# EAGLE design slave-16 (EAGLE 9.6.2)
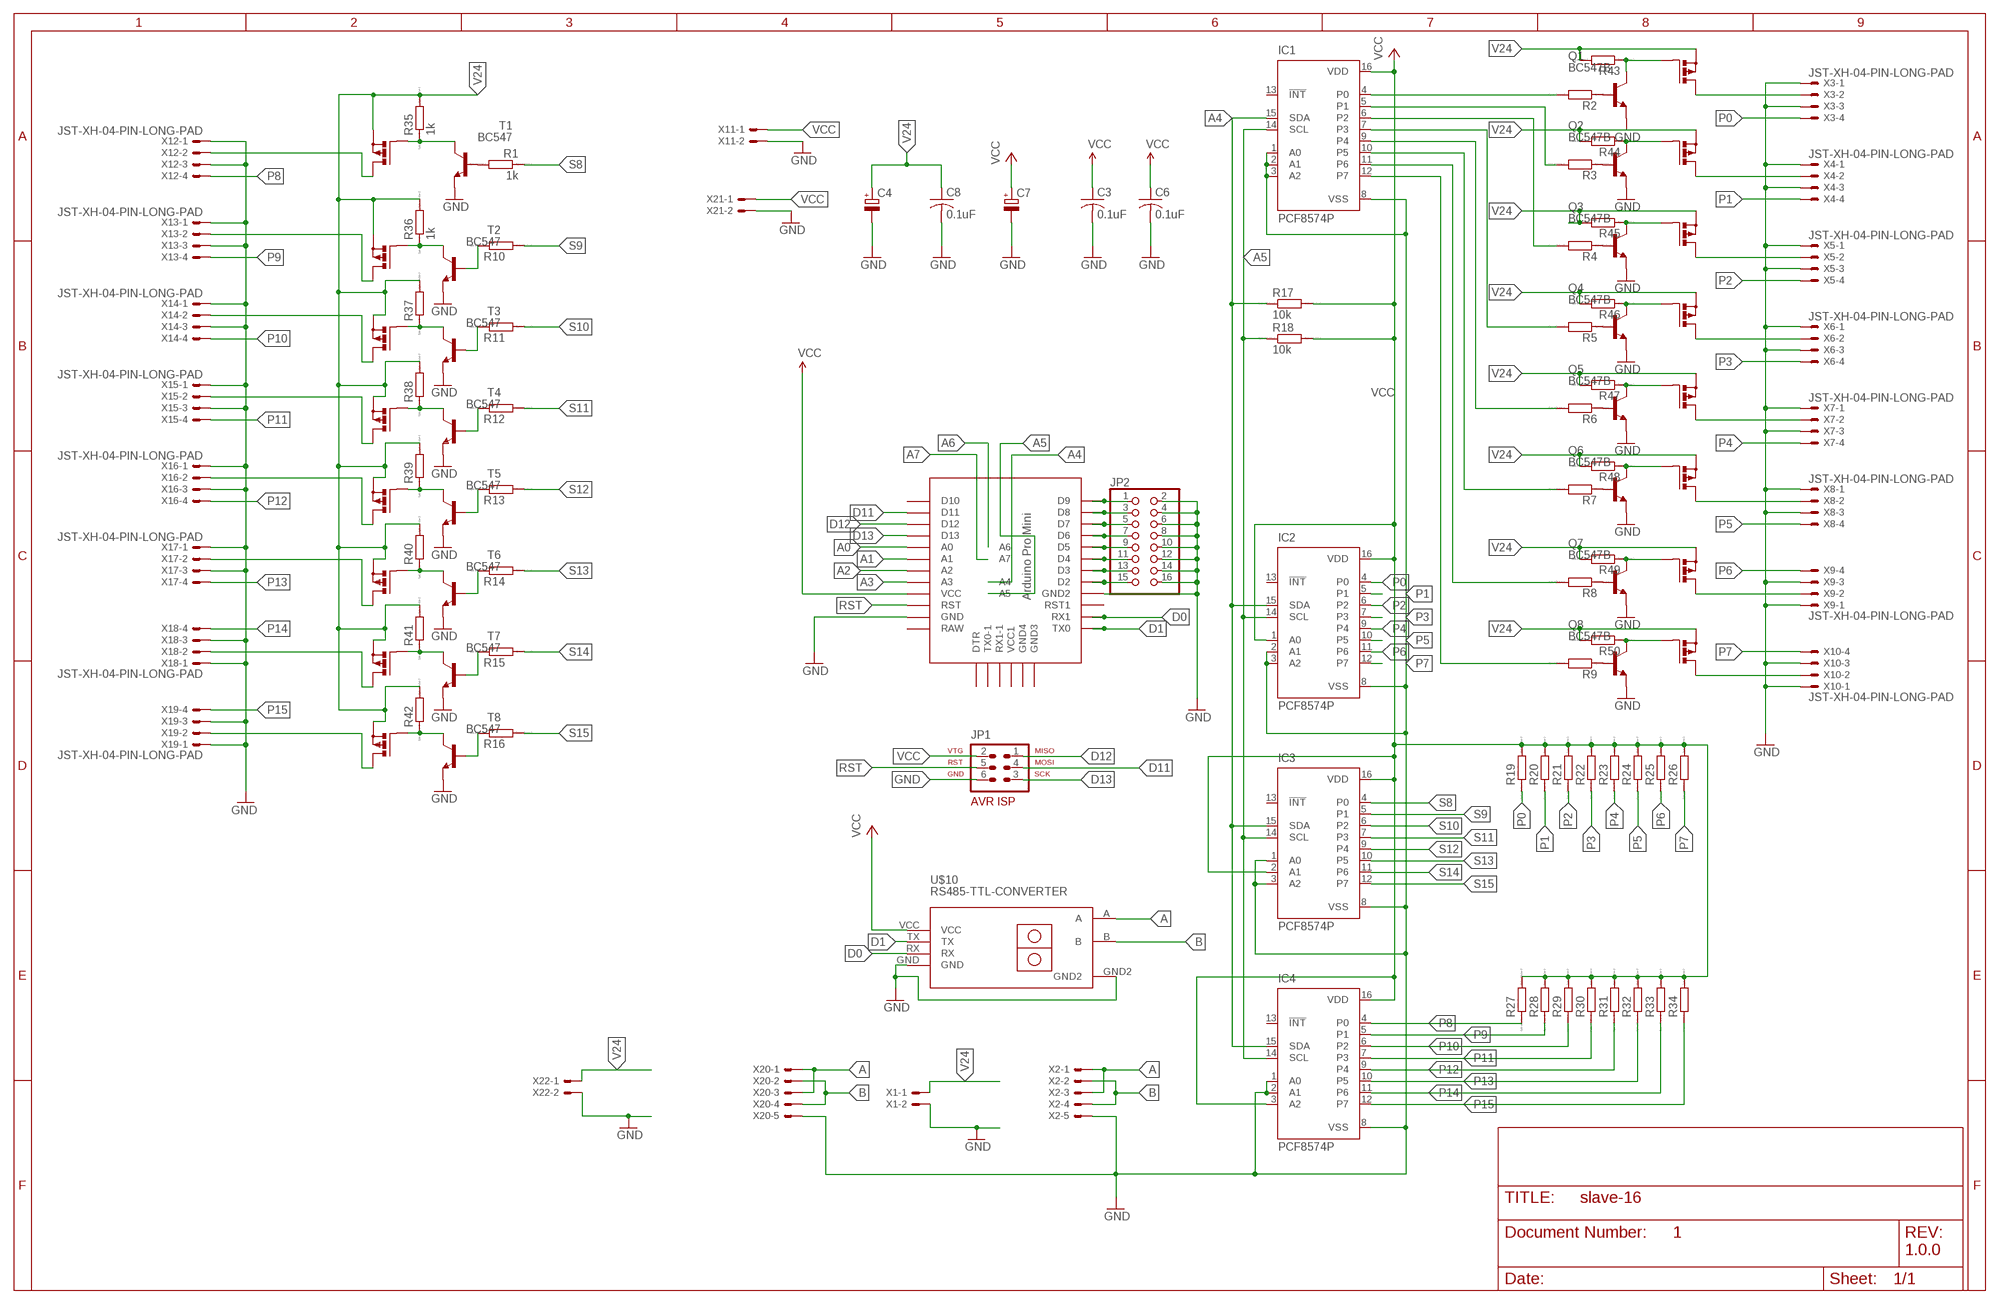
[diagram p0: schematic, sheet 1]
FRAME1 (FRAME_B_L): DESIGNER: PRATIK MAKWANA; DOC: 1; REV: 1.0.0

## Parts
C3  0.1uF  C-USC0805  [C0805]
C4  CPOL-EUSANYO_SMD_C6  [SANYO-OSCON_SMD_C6]
C6  0.1uF  C-USC0805  [C0805]
C7  CPOL-EUSANYO_SMD_C6  [SANYO-OSCON_SMD_C6]
C8  0.1uF  C-USC0805  [C0805]
IC1  PCF8574P  [DIL16]
IC2  PCF8574P  [DIL16]
IC3  PCF8574P  [DIL16]
IC4  PCF8574P  [DIL16]
JP1  AVR-ISP-6  [AVR-ISP-6]
JP2  PINHD-2X8  [2X08]
Q1  BC547B  [TO92]
Q2  BC547B  [TO92]
Q3  BC547B  [TO92]
Q4  BC547B  [TO92]
Q5  BC547B  [TO92]
Q6  BC547B  [TO92]
Q7  BC547B  [TO92]
Q8  BC547B  [TO92]
R1  1k  RR1206  [R1206]
R2  RR1206  [R1206]
R3  RR1206  [R1206]
R4  RR1206  [R1206]
R5  RR1206  [R1206]
R6  RR1206  [R1206]
R7  RR1206  [R1206]
R8  RR1206  [R1206]
R9  RR1206  [R1206]
R10  RR1206  [R1206]
R11  RR1206  [R1206]
R12  RR1206  [R1206]
R13  RR1206  [R1206]
R14  RR1206  [R1206]
R15  RR1206  [R1206]
R16  RR1206  [R1206]
R17  10k  RR1206  [R1206]
R18  10k  RR1206  [R1206]
R19  RR1206  [R1206]
R20  RR1206  [R1206]
R21  RR1206  [R1206]
R22  RR1206  [R1206]
R23  RR1206  [R1206]
R24  RR1206  [R1206]
R25  RR1206  [R1206]
R26  RR1206  [R1206]
R27  RR1206  [R1206]
R28  RR1206  [R1206]
R29  RR1206  [R1206]
R30  RR1206  [R1206]
R31  RR1206  [R1206]
R32  RR1206  [R1206]
R33  RR1206  [R1206]
R34  RR1206  [R1206]
R35  1k  RR1206  [R1206]
R36  1k  RR1206  [R1206]
R37  RR1206  [R1206]
R38  RR1206  [R1206]
R39  RR1206  [R1206]
R40  RR1206  [R1206]
R41  RR1206  [R1206]
R42  RR1206  [R1206]
R43  RR1206  [R1206]
R44  RR1206  [R1206]
R45  RR1206  [R1206]
R46  RR1206  [R1206]
R47  RR1206  [R1206]
R48  RR1206  [R1206]
R49  RR1206  [R1206]
R50  RR1206  [R1206]
T1  BC547  [TO92]
T2  BC547  [TO92]
T3  BC547  [TO92]
T4  BC547  [TO92]
T5  BC547  [TO92]
T6  BC547  [TO92]
T7  BC547  [TO92]
T8  BC547  [TO92]
U$1  IRLML6402  [SOT-23]
U$2  IRLML6402  [SOT-23]
U$3  IRLML6402  [SOT-23]
U$4  IRLML6402  [SOT-23]
U$5  IRLML6402  [SOT-23]
U$6  IRLML6402  [SOT-23]
U$7  IRLML6402  [SOT-23]
U$8  IRLML6402  [SOT-23]
U$10  RS485-TTL-CONVERTER  [RS485-TTL-CONVERTER]
U$12  IRLML6402  [SOT-23]
U$13  IRLML6402  [SOT-23]
U$14  IRLML6402  [SOT-23]
U$15  IRLML6402  [SOT-23]
U$16  IRLML6402  [SOT-23]
U$17  IRLML6402  [SOT-23]
U$18  IRLML6402  [SOT-23]
U$19  IRLML6402  [SOT-23]
U$20  PRO-MINI-2  [PRO-MINI-2]
X1  JST-XH-02-PIN-LONG-PAD  [JST-XH-02-PACKAGE-LONG-PAD]
X2  JST-XH-05-PIN-LONG-PAD  [JST-XH-05-PACKAGE-LONG-PAD]
X3  JST-XH-04-PIN-LONG-PAD  [JST-XH-04-PACKAGE-LONG-PAD]
X4  JST-XH-04-PIN-LONG-PAD  [JST-XH-04-PACKAGE-LONG-PAD]
X5  JST-XH-04-PIN-LONG-PAD  [JST-XH-04-PACKAGE-LONG-PAD]
X6  JST-XH-04-PIN-LONG-PAD  [JST-XH-04-PACKAGE-LONG-PAD]
X7  JST-XH-04-PIN-LONG-PAD  [JST-XH-04-PACKAGE-LONG-PAD]
X8  JST-XH-04-PIN-LONG-PAD  [JST-XH-04-PACKAGE-LONG-PAD]
X9  JST-XH-04-PIN-LONG-PAD  [JST-XH-04-PACKAGE-LONG-PAD]
X10  JST-XH-04-PIN-LONG-PAD  [JST-XH-04-PACKAGE-LONG-PAD]
X11  JST-XH-02-PIN-LONG-PAD  [JST-XH-02-PACKAGE-LONG-PAD]
X12  JST-XH-04-PIN-LONG-PAD  [JST-XH-04-PACKAGE-LONG-PAD]
X13  JST-XH-04-PIN-LONG-PAD  [JST-XH-04-PACKAGE-LONG-PAD]
X14  JST-XH-04-PIN-LONG-PAD  [JST-XH-04-PACKAGE-LONG-PAD]
X15  JST-XH-04-PIN-LONG-PAD  [JST-XH-04-PACKAGE-LONG-PAD]
X16  JST-XH-04-PIN-LONG-PAD  [JST-XH-04-PACKAGE-LONG-PAD]
X17  JST-XH-04-PIN-LONG-PAD  [JST-XH-04-PACKAGE-LONG-PAD]
X18  JST-XH-04-PIN-LONG-PAD  [JST-XH-04-PACKAGE-LONG-PAD]
X19  JST-XH-04-PIN-LONG-PAD  [JST-XH-04-PACKAGE-LONG-PAD]
X20  JST-XH-05-PIN-LONG-PAD  [JST-XH-05-PACKAGE-LONG-PAD]
X21  JST-XH-02-PIN-LONG-PAD  [JST-XH-02-PACKAGE-LONG-PAD]
X22  JST-XH-02-PIN-LONG-PAD  [JST-XH-02-PACKAGE-LONG-PAD]

## Nets
A: U$10.A X2.1 X2.3 X20.1 X20.3
A0: U$20.A0
A1: U$20.A1
A2: U$20.A2
A3: U$20.A3
A4: IC1.15(SDA) IC2.15(SDA) IC3.15(SDA) IC4.15(SDA) R17.1 U$20.A4
A5: IC1.14(SCL) IC2.14(SCL) IC3.14(SCL) IC4.14(SCL) R18.1 U$20.A5
A6: U$20.A6
A7: U$20.A7
B: U$10.B X2.2 X2.4 X20.2 X20.4
D0: U$10.RX U$20.RX1
D1: U$10.TX U$20.TX0
D11: JP1.4 U$20.D11
D12: JP1.1 U$20.D12
D13: JP1.3 U$20.D13
GND: C3.2 C4.- C6.2 C7.- C8.2 IC1.1(A0) IC1.2(A1) IC1.3(A2) IC1.8(VSS) IC2.2(A1) IC2.3(A2) IC2.8(VSS) IC3.1(A0) IC3.3(A2) IC3.8(VSS) IC4.1(A0) IC4.2(A1) IC4.8(VSS) JP1.6 JP2.2 JP2.4 JP2.6 JP2.8 JP2.10 JP2.12 JP2.14 JP2.16 Q1.1(E) Q2.1(E) Q3.1(E) Q4.1(E) Q5.1(E) Q6.1(E) Q7.1(E) Q8.1(E) T1.1(E) T2.1(E) T3.1(E) T4.1(E) T5.1(E) T6.1(E) T7.1(E) T8.1(E) U$10.GND U$10.GND2 U$20.GND U$20.GND1(GND2) X1.2 X2.5 X3.1 X3.3 X4.1 X4.3 X5.1 X5.3 X6.1 X6.3 X7.1 X7.3 X8.1 X8.3 X9.1 X9.3 X10.1 X10.3 X11.2 X12.1 X12.3 X13.1 X13.3 X14.1 X14.3 X15.1 X15.3 X16.1 X16.3 X17.1 X17.3 X18.1 X18.3 X19.1 X19.3 X20.5 X21.2 X22.2
N$1: Q8.2(B) R9.1
N$2: Q7.2(B) R8.1
N$3: R15.1 T7.2(B)
N$4: Q6.2(B) R7.1
N$5: Q5.2(B) R6.1
N$6: Q4.2(B) R5.1
N$7: Q3.2(B) R4.1
N$8: Q2.2(B) R3.1
N$9: Q1.2(B) R2.1
N$10: JP2.15 U$20.D2
N$11: Q1.3(C) R43.1 U$1.P1(G)
N$12: Q2.3(C) R44.1 U$2.P1(G)
N$13: Q3.3(C) R45.1 U$3.P1(G)
N$14: Q4.3(C) R46.1 U$4.P1(G)
N$15: U$1.P3(D) X3.2
N$16: U$2.P3(D) X4.2
N$17: JP2.13 U$20.D3
N$18: U$3.P3(D) X5.2
N$19: U$4.P3(D) X6.2
N$20: JP2.11 U$20.D4
N$21: JP2.9 U$20.D5
N$22: JP2.7 U$20.D6
N$23: JP2.5 U$20.D7
N$24: JP2.3 U$20.D8
N$25: JP2.1 U$20.D9
N$26: R1.2 T1.2(B)
N$27: R35.1 T1.3(C) U$12.P1(G)
N$28: R42.1 T8.3(C) U$19.P1(G)
N$29: R40.1 T6.3(C) U$17.P1(G)
N$30: IC1.4(P0) R2.2
N$31: IC1.5(P1) R3.2
N$32: IC1.6(P2) R4.2
N$33: IC1.7(P3) R5.2
N$34: IC1.9(P4) R6.2
N$35: IC1.10(P5) R7.2
N$36: IC1.11(P6) R8.2
N$37: IC1.12(P7) R9.2
N$38: R16.1 T8.2(B)
N$39: R14.1 T6.2(B)
N$40: U$5.P3(D) X7.2
N$41: U$6.P3(D) X8.2
N$42: U$7.P3(D) X9.2
N$43: R39.1 T5.3(C) U$16.P1(G)
N$44: R41.1 T7.3(C) U$18.P1(G)
N$45: R13.1 T5.2(B)
N$46: U$12.P3(D) X12.2
N$47: U$13.P3(D) X13.2
N$48: U$14.P3(D) X14.2
N$49: U$15.P3(D) X15.2
N$50: U$16.P3(D) X16.2
N$51: U$17.P3(D) X17.2
N$52: U$18.P3(D) X18.2
N$53: U$19.P3(D) X19.2
N$54: U$8.P3(D) X10.2
N$55: R38.1 T4.3(C) U$15.P1(G)
N$56: Q8.3(C) R50.1 U$8.P1(G)
N$57: R12.1 T4.2(B)
N$58: R37.1 T3.3(C) U$14.P1(G)
N$59: Q7.3(C) R49.1 U$7.P1(G)
N$60: R11.1 T3.2(B)
N$61: R10.1 T2.2(B)
N$62: R36.1 T2.3(C) U$13.P1(G)
N$63: Q6.3(C) R48.1 U$6.P1(G)
N$64: Q5.3(C) R47.1 U$5.P1(G)
P0: IC2.4(P0) R19.1 X3.4
P1: IC2.5(P1) R20.1 X4.4
P2: IC2.6(P2) R21.1 X5.4
P3: IC2.7(P3) R22.1 X6.4
P4: IC2.9(P4) R23.1 X7.4
P5: IC2.10(P5) R24.1 X8.4
P6: IC2.11(P6) R25.1 X9.4
P7: IC2.12(P7) R26.1 X10.4
P8: IC4.4(P0) R27.1 X12.4
P9: IC4.5(P1) R28.1 X13.4
P10: IC4.6(P2) R29.1 X14.4
P11: IC4.7(P3) R30.1 X15.4
P12: IC4.9(P4) R31.1 X16.4
P13: IC4.10(P5) R32.1 X17.4
P14: IC4.11(P6) R33.1 X18.4
P15: IC4.12(P7) R34.1 X19.4
RST: JP1.5 U$20.RST
S8: IC3.4(P0) R1.1
S9: IC3.5(P1) R10.2
S10: IC3.6(P2) R11.2
S11: IC3.7(P3) R12.2
S12: IC3.9(P4) R13.2
S13: IC3.10(P5) R14.2
S14: IC3.11(P6) R15.2
S15: IC3.12(P7) R16.2
V24: C4.+ C8.1 R35.2 R36.2 R37.2 R38.2 R39.2 R40.2 R41.2 R42.2 R43.2 R44.2 R45.2 R46.2 R47.2 R48.2 R49.2 R50.2 U$1.P2(S) U$2.P2(S) U$3.P2(S) U$4.P2(S) U$5.P2(S) U$6.P2(S) U$7.P2(S) U$8.P2(S) U$12.P2(S) U$13.P2(S) U$14.P2(S) U$15.P2(S) U$16.P2(S) U$17.P2(S) U$18.P2(S) U$19.P2(S) X1.1 X22.1
VCC: C3.1 C6.1 C7.+ IC1.16(VDD) IC2.1(A0) IC2.16(VDD) IC3.2(A1) IC3.16(VDD) IC4.3(A2) IC4.16(VDD) JP1.2 R17.2 R18.2 R19.2 R20.2 R21.2 R22.2 R23.2 R24.2 R25.2 R26.2 R27.2 R28.2 R29.2 R30.2 R31.2 R32.2 R33.2 R34.2 U$10.VCC U$20.VCC X11.1 X21.1
Unconnected: IC1.13(!INT) IC2.13(!INT) IC3.13(!INT) IC4.13(!INT) U$20.D10 U$20.DTR U$20.GND2(GND3) U$20.GND3(GND4) U$20.RAW U$20.RST1 U$20.RX1-1 U$20.TX0-1 U$20.VCC1

## Library data of the parts
C3 C6 C8 = adafruit:C-US: CAPACITOR, American symbol
C4 C7 = rcl:CPOL-EU: POLARIZED CAPACITOR, European symbol; SPICEPREFIX: C
IC1-IC4 = micro-philips:PCF8574: I2C-Bus Remote 8-bit I/O expander http://www.semiconductors.philips.com/acrobat_download/datasheets/PCF8574_4.pdf; MPN: PCF8574PN; OC_FARNELL: 204020; OC_NEWARK: 11N8515
JP1 = atmel-1:AVR-ISP-6: AVR ISP-6 Serial Programming Header
JP2 = pinhead-zmiany-JP:PINHD-2X8: PIN HEADER
Q1-Q8 = transistor-npn:BC547*: NPN Transistor
R1-R50 = eagle-ltspice:R: RESISTOR, European symbol; SPICEMODEL: NONE; SPICEPREFIX: R
T1-T8 = transistor:BC547: NPN TRANSISTOR
U$1-U$8 U$12-U$19 = mosfet:IRLML6402: Pch MOSFET IRLML6402 20V 3.7A http://akizukidenshi.com/catalog/g/gI-02553/ I-02553
U$10 = zort-library:RS485-TTL-CONVERTER: RS485 to TTL converter based on MAX485 chip
U$20 = Arduino-clone:PRO-MINI-2: Arduino Pro Mini Layout 2 Sparkfun.com
X1 X11 X21 X22 = Rembrandt Electronics - JST XH Connectors v1-0:JST-XH-02-PIN: JST XH Connector 2 Pin Wire to board connector. Pitch: 2,54 mm, (0.100") Number of pins: 2 Created by Rembrandt Electronics www.rembrandtelectronics.com
X2 X20 = Rembrandt Electronics - JST XH Connectors v1-0:JST-XH-05-PIN: JST XH Connector 2 Pin Wire to board connector. Pitch: 2,54 mm, (0.100") Number of pins: 5 Created by Rembrandt Electronics www.rembrandtelectronics.com
X3-X10 X12-X19 = Rembrandt Electronics - JST XH Connectors v1-0:JST-XH-04-PIN: JST XH Connector 2 Pin Wire to board connector. Pitch: 2,54 mm, (0.100") Number of pins: 4 Created by Rembrandt Electronics www.rembrandtelectronics.com

## Board
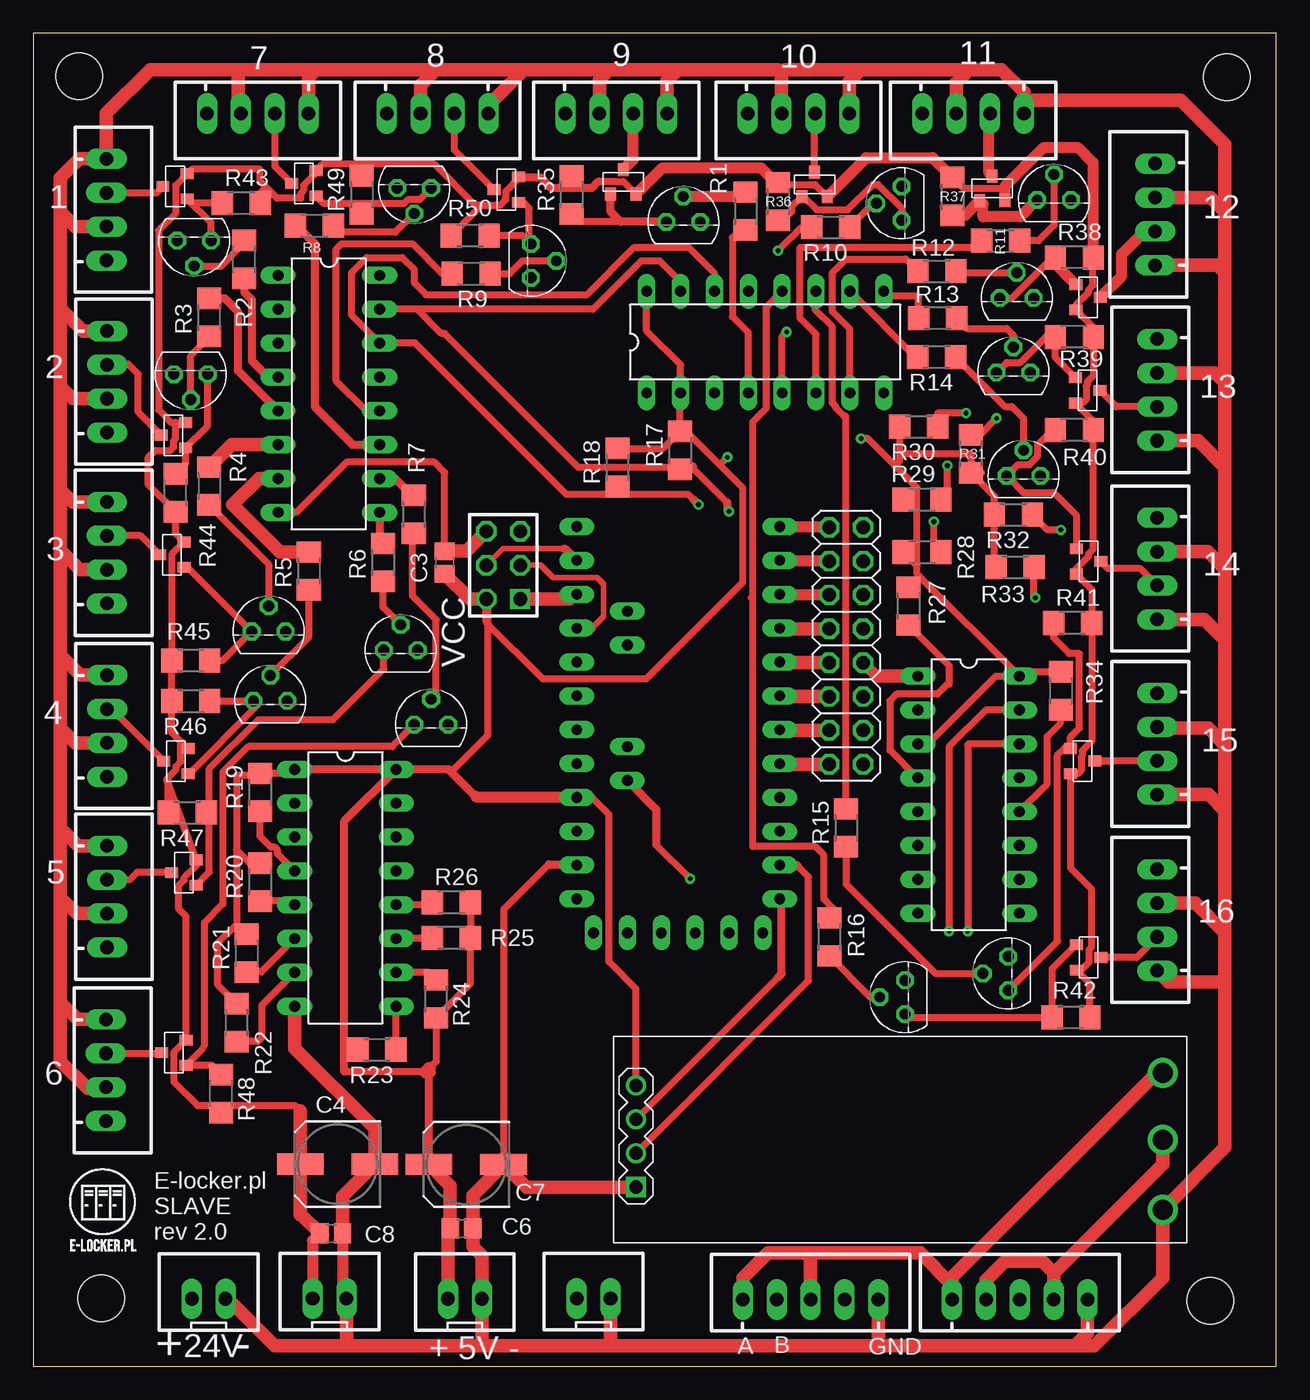
[diagram p1: board, top side]
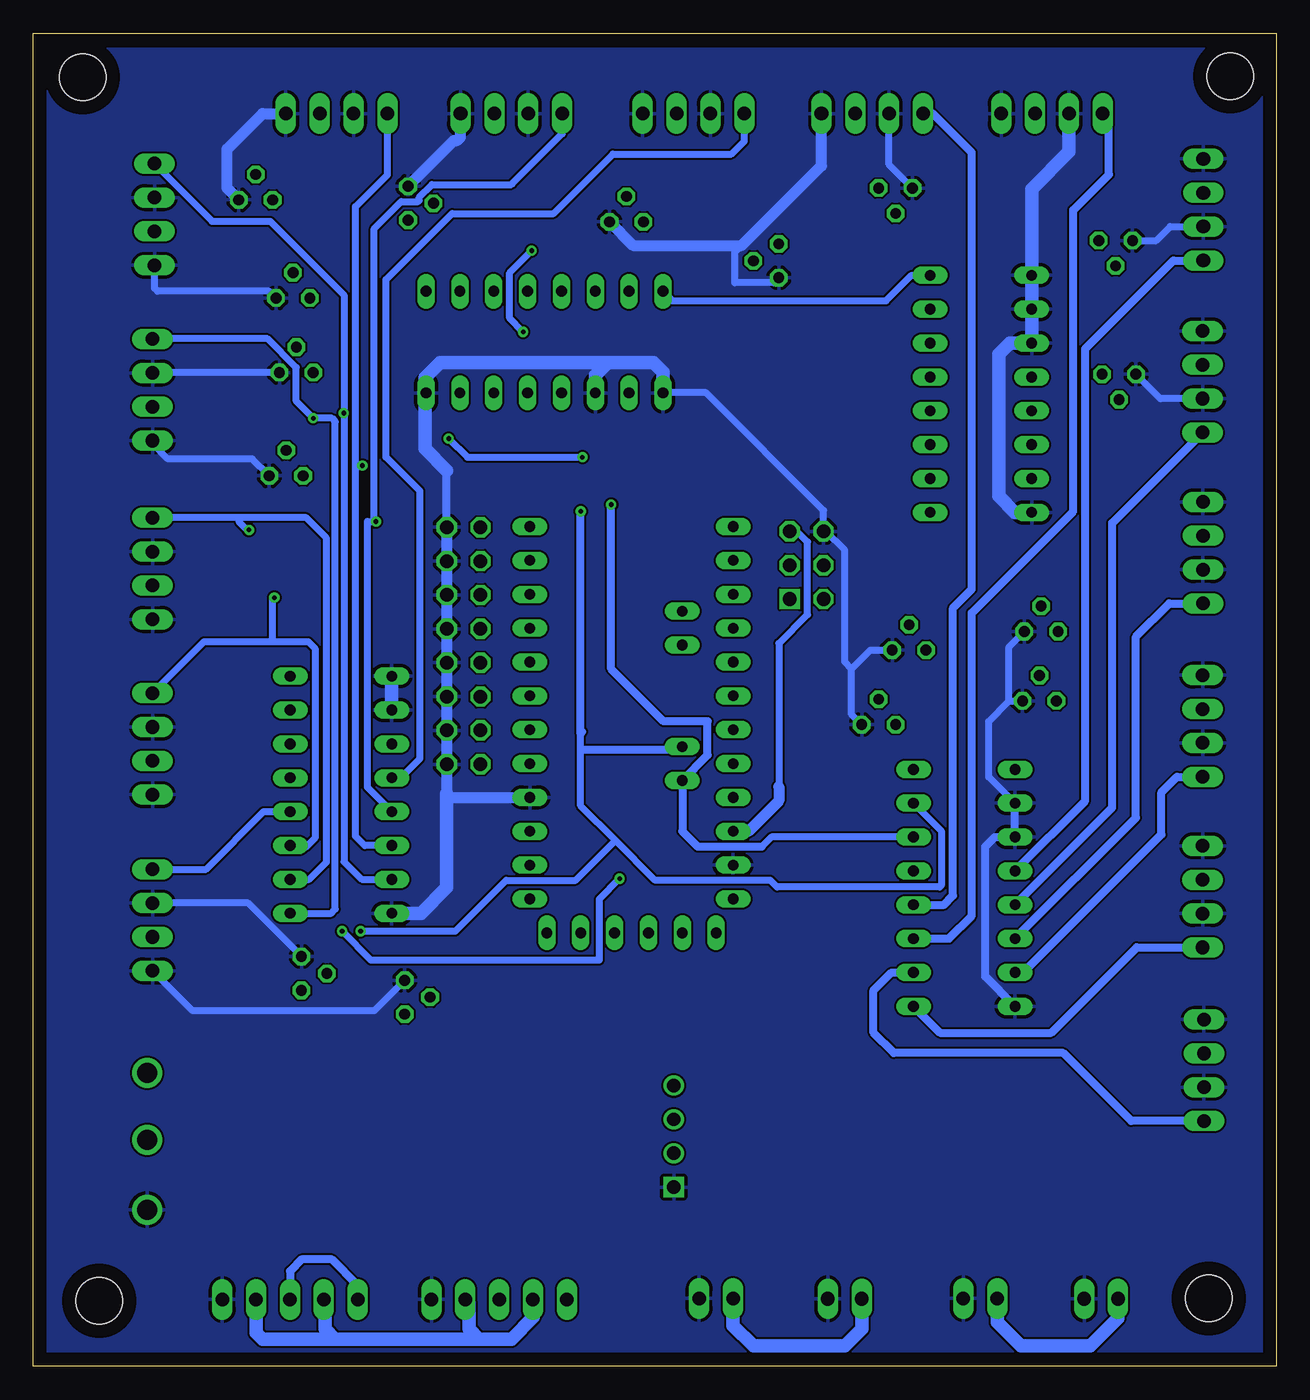
[diagram p2: board, bottom side, seen from below]

Size 93.27 x 100 mm. Coordinates in mm from the lower left corner, seen from the top.
Outline: 0,0 93.27,0 93.27,100 0,100 0,0
Copper layers (1*16): Top 0.035mm / dielectric 1.5mm / Bottom 0.035mm
Design rules "default": minimum track width 6mil, minimum drill 0.35mm, track to track 6mil, track to pad 6mil, pad to pad 6mil, via to via 6mil, smd to smd 6mil, copper to edge 40mil, drill to drill 6mil, minimum pad ring 10mil, minimum via ring 8mil, stop-mask expansion 4mil, vias tented up to drill 0mil, thermal gap 10mil
Holes 3.5 mm at 5.08,5.08 88.32,4.9 89.56,96.7 3.45,96.77

### Footprints (pad centres in the part's own frame; a part is rotated, then mirrored left to right if it is on the bottom)
C0805 = smd 1.3 x 1.5: 1 -0.85,0; 2 0.85,0
SANYO-OSCON_SMD_C6 = smd 3.5 x 1.6: + 2.8,0; - -2.8,0
DIL16 = drill 0.813 long: 1 -8.89,-3.81; 2 -6.35,-3.81; 3 -3.81,-3.81; 4 -1.27,-3.81; 5 1.27,-3.81; 6 3.81,-3.81; 7 6.35,-3.81; 8 8.89,-3.81; 9 8.89,3.81; 10 6.35,3.81; 11 3.81,3.81; 12 1.27,3.81; 13 -1.27,3.81; 14 -3.81,3.81; 15 -6.35,3.81; 16 -8.89,3.81
AVR-ISP-6 = drill 1.016 square: 1 -2.54,-1.27 | drill 1.016 octagon: 2 -2.54,1.27; 3 0,-1.27; 4 0,1.27; 5 2.54,-1.27; 6 2.54,1.27
2X08 = drill 1.016 octagon: 1 -8.89,-1.27; 2 -8.89,1.27; 3 -6.35,-1.27; 4 -6.35,1.27; 5 -3.81,-1.27; 6 -3.81,1.27; 7 -1.27,-1.27; 8 -1.27,1.27; 9 1.27,-1.27; 10 1.27,1.27; 11 3.81,-1.27; 12 3.81,1.27; 13 6.35,-1.27; 14 6.35,1.27; 15 8.89,-1.27; 16 8.89,1.27
TO92 = drill 0.813 octagon: 1 1.27,0; 2 0,1.905; 3 -1.27,0
R1206 = smd 1.6 x 1.803: 1 -1.422,0; 2 1.422,0
SOT-23 = smd 0.802 x 0.972: P1 -0.95,-0.917; P2 0.95,-0.917; P3 0,0.917
RS485-TTL-CONVERTER = drill 1.5: A 41.2,12.75; B 41.2,7.75; GND2 41.2,2.5 | drill 1 square: GND 1.68,4.19 | drill 1: RX 1.68,6.73; TX 1.68,9.27; VCC 1.68,11.81
PRO-MINI-2 = drill 0.8 long: A0 6.35,2.54; A1 6.35,0; A2 6.35,-2.54; A3 6.35,-5.08; A4 2.54,1.27; A5 2.54,3.81; A6 2.54,-8.89; A7 2.54,-6.35; D2 -8.89,2.54; D3 -8.89,0; D4 -8.89,-2.54; D5 -8.89,-5.08; D6 -8.89,-7.62; D7 -8.89,-10.16; D8 -8.89,-12.7; D9 -8.89,-15.24; D10 6.35,-15.24; D11 6.35,-12.7; D12 6.35,-10.16; D13 6.35,-7.62; DTR 5.08,15.24; GND 6.35,10.16; GND1 -8.89,5.08; GND2 -7.62,15.24; GND3 -5.08,15.24; RAW 6.35,12.7; RST 6.35,7.62; RST1 -8.89,7.62; RX1 -8.89,10.16; RX1-1 0,15.24; TX0 -8.89,12.7; TX0-1 2.54,15.24; VCC 6.35,5.08; VCC1 -2.54,15.24
JST-XH-02-PACKAGE-LONG-PAD = drill 1.016 long: 1 -1.27,0; 2 1.27,0
JST-XH-05-PACKAGE-LONG-PAD = drill 1.016 long: 1 -5.08,0; 2 -2.54,0; 3 0,0; 4 2.54,0; 5 5.08,0
JST-XH-04-PACKAGE-LONG-PAD = drill 1.016 long: 1 -3.81,0; 2 -1.27,0; 3 1.27,0; 4 3.81,0

### Placement (x,y rotation side)
C3  30.86,60.3 90 top
C4  22.83,15.16 180 top
C6  32.13,10.34 0 top
C7  32.49,15.14 180 top
C8  22.35,9.96 0 top
IC1  22.17,72.95 270 top
IC2  23.42,35.89 270 top
IC3  54.91,76.83 0 top
IC4  70.18,42.88 270 top
JP1  35.26,60.1 90 top
JP2  60.99,54.05 270 top
Q1  12.06,84.45 180 top
Q2  11.81,74.42 180 top
Q3  17.65,55.12 0 top
Q4  17.78,49.91 0 top
Q5  27.56,53.72 0 top
Q6  29.84,48.13 0 top
Q7  28.57,88.39 180 top
Q8  37.34,82.93 270 top
R1  53.44,86.66 90 top
R2  15.82,83.03 270 top
R3  13.18,78.69 90 top
R4  13.21,66.04 90 top
R5  20.68,59.66 90 top
R6  26.24,60.3 90 top
R7  28.55,63.91 90 top
R8  21.08,85.57 180 top
R9  32.84,81.97 180 top
R10  59.82,85.45 180 top
R11  72.57,84.43 180 top
R12  67.79,82.14 180 top
R13  67.84,78.64 180 top
R14  67.77,75.72 180 top
R15  60.99,40.39 90 top
R16  59.72,32.21 90 top
R17  48.51,68.71 90 top
R18  43.81,67.44 90 top
R19  17.02,43.05 90 top
R20  17.02,36.32 90 top
R21  16,30.99 90 top
R22  15.24,25.78 90 top
R23  25.78,23.75 180 top
R24  30.23,27.56 270 top
R25  31.37,32.13 0 top
R26  31.37,34.8 0 top
R27  65.66,57.02 90 top
R28  66.67,61.09 180 top
R29  66.67,65.02 180 top
R30  66.42,70.48 180 top
R31  70.36,68.45 270 top
R32  73.53,63.88 180 top
R33  73.66,59.94 180 top
R34  77.09,50.67 90 top
R35  40.39,87.88 90 top
R36  55.88,87.38 90 top
R37  68.96,87.76 90 top
R38  78.11,83.19 0 top
R39  78.11,77.22 0 top
R40  78.11,70.23 0 top
R41  77.98,55.75 0 top
R42  77.85,26.16 0 top
R43  15.62,87.25 0 top
R44  10.67,65.53 270 top
R45  11.81,52.96 180 top
R46  11.81,49.91 180 top
R47  11.56,41.53 180 top
R48  14.1,20.45 270 top
R49  24.64,87.88 90 top
R50  32.77,84.84 180 top
T1  48.77,85.85 0 top
T2  65.15,87.25 90 top
T3  76.58,87.5 0 top
T4  73.79,80.14 0 top
T5  73.53,74.55 0 top
T6  74.3,66.8 0 top
T7  73.15,29.46 90 top
T8  65.41,27.69 90 top
U$1  10.64,88.52 90 top
U$2  10.52,69.85 90 top
U$3  10.39,60.88 90 top
U$4  10.69,45.39 90 top
U$5  11.3,37.03 90 top
U$6  10.54,23.52 90 top
U$7  20.29,88.75 90 top
U$8  35.48,88.27 90 top
U$9  [ELOCKER]  2.69,8.41 0 top
U$10  43.54,9.25 0 top
U$12  44.26,88.85 0 top
U$13  58.61,88.66 0 top
U$14  71.95,88.35 0 top
U$15  79.15,80.2 270 top
U$16  79.09,73.21 270 top
U$17  79.16,60.39 270 top
U$18  78.73,45.4 270 top
U$19  79.18,30.67 270 top
U$20  47.12,47.75 180 top
X1  13.16,5.05 0 top
X2  58.32,5 0 top
X3  5.49,86.77 270 top
X4  5.54,73.86 270 top
X5  5.51,61.04 270 top
X6  5.54,48.03 270 top
X7  5.54,35.23 270 top
X8  5.44,22.2 270 top
X9  16.84,93.98 180 top
X10  30.33,93.98 180 top
X11  32.38,5.05 0 top
X12  43.74,93.98 180 top
X13  57.4,93.98 180 top
X14  70.51,93.98 180 top
X15  84.18,86.41 90 top
X16  84.33,73.25 90 top
X17  84.33,59.84 90 top
X18  84.33,46.69 90 top
X19  84.33,33.48 90 top
X20  74.02,5 0 top
X21  42.04,5.08 0 top
X22  22.23,5.08 0 top

### Tracks (layer width: path | path; a pad name or v marks a point on that pad's centre or on a via)
A
  Top 0.508: 68.94,6.66 68.94,5.84 X20.1
  Top 1.016: X2.1 53.24,6.63 55.12,8.51 57.91,8.51 | 57.91,8.51 58.32,8.1 X2.3 | 57.91,8.51 66.55,8.51 68.94,6.12 68.94,5.84 | X20.1 68.94,6.66 84.28,22 U$10.A
  Bottom 0.61: X20.1 68.94,6.07 70.87,8 73.15,8 74.02,7.14 X20.3
A4  (via drill 0.35)
  Top 0.508: 28.78,79.3 30.61,77.47 30.86,77.47 40.89,67.44 49.4,67.44 52.05,64.8 | 28.78,79.3 41.99,79.3 45.62,82.93 46.99,82.93 48.56,81.36 IC3.15 | 28.78,79.3 IC1.15 | IC4.15 71.45,49.23 68.71,46.48 v68.71,32.64
  Top 0.61: 52.05,64.8 52.05,64.29 v52.2,64.14
  Top 0.813: R17.1 48.67,67.44 49.4,67.44
  Bottom 0.508: IC2.15 25.15,40.16 25.15,36.07 25.27,35.94 37.47,35.94 37.97,36.45 46.61,36.45 49.59,39.43 | 49.59,39.43 52.2,42.04 52.2,46.23 52.2,47.45 52.05,47.6 | v68.71,32.64 61.59,32.64 57.78,36.45 52.58,36.45 49.59,39.43
  Bottom 0.61: U$20.A4 44.83,46.23 52.2,46.23 | 52.2,47.45 v52.2,64.14
A5  (via drill 0.35)
  Top 0.508: 49.51,65.05 49.15,65.41 43.56,65.41 | 43.56,65.41 40.01,65.41 28.65,76.76 IC1.14 23.88,78.87 23.88,82.04 25.02,83.19 27.69,83.19 28.57,82.3 28.57,81.28 29.46,80.39 41.53,80.39 45.09,83.95 49.15,83.95 51.1,81.99 IC3.14 | IC4.14 70.18,46.69 70.1,46.61 v70.1,32.64 | v49.28,36.58 46.74,39.12 46.74,39.24 | R18.1 43.56,65.76 43.56,65.41
  Top 0.61: U$20.A5 46.74,41.78 46.74,39.12 | 49.51,65.05 v49.91,64.64
  Bottom 0.508: IC2.14 37.9,39.7 38.61,38.99 | v70.1,32.64 67.94,30.48 50.8,30.48 50.8,35.05 v49.28,36.58
  Bottom 0.61: v49.91,64.64 49.91,52.32 45.97,48.39 42.67,48.39 42.67,45.85 U$20.A5 44.58,40.13 43.43,38.99 38.61,38.99
B
  Top 0.508: 84.64,15.05 84.74,15.14 | 76.56,6.96 76.71,7.11
  Top 1.016: X20.2 71.48,6.45 72.9,7.87 75.69,7.87 76.56,7.01 76.56,6.96 X20.4 | 76.71,7.11 84.64,15.05 | 84.74,15.14 U$10.B
  Bottom 0.508: X2.4
  Bottom 1.016: X2.2 55.78,3.66 57.4,2.03 59.82,2.03 | 59.82,2.03 60.58,2.79 60.58,4.72 X2.4 | 59.82,2.03 70.61,2.03 | 70.61,2.03 71.37,2.79 71.37,4.9 X20.2 | 70.61,2.03 76.07,2.03 76.56,2.52 X20.4
D0
  Top 0.508: U$10.RX 58.17,28.93 58.17,36.7 57.4,37.47 57.2,37.67
  Top 0.61: U$20.RX1 57.28,37.59 57.4,37.47
D1
  Top 0.508: U$10.TX 55.85,29.16
  Top 0.61: 55.85,29.16 56.13,29.43 56.13,34.92 U$20.TX0
D11
  Top 0.406: JP1.4 35.23,61.34 39.8,61.34
  Top 0.61: 39.8,61.34 39.88,61.34 U$20.D11
D12
  Top 0.813: U$20.D12 39.85,57.91 39.5,57.56
  Top 1.016: JP1.1 39.5,57.56 40.18,57.56
D13
  Top 0.406: JP1.3 38.08,60.1 38.99,59.18 42.29,59.18 42.8,58.67 42.8,56.26 41.91,55.37 41.83,55.45
  Top 0.61: U$20.D13 41.91,55.37
GND
  Top 0.406: 40.41,1.52 40.41,1.27 18.21,1.27 X1.2
  Top 0.508: C7.- 35.31,15.16 35.31,34.29 38.68,37.67 | C3.2 30.86,67.06 30.1,67.82 23.5,67.82 19.74,64.06 IC1.8
  Top 0.61: U$20.GND 38.76,37.59 38.68,37.67
  Top 0.813: 63.27,51.77 JP2.10 | C8.2 23.2,5.37 X22.2
  Top 1.016: C8.2 23.2,12.73 C4.- 25.64,17.83 19.61,23.86 IC2.8 | 33.66,1.52 X11.2 33.66,8.27 32.98,8.94 C6.2 32.98,12.83 C7.- 36.99,13.44 U$10.GND | 33.66,1.52 40.41,1.52 43.31,1.52 | 63.4,1.52 X2.5 | X20.5 79.1,2.46 78.16,1.52 | 78.16,1.52 63.4,1.52 | 78.16,1.52 79.62,1.52 84.74,6.64 U$10.GND2 89.41,16.42 89.41,28.83 | 89.41,28.83 85.17,28.83 X19.1 | 89.41,28.83 89.41,32.51 | X19.3 87.17,34.75 89.41,32.51 | 89.41,32.51 89.41,41.66 | X18.1 88.19,42.88 89.41,41.66 | 89.41,41.66 89.41,46.61 | 89.41,46.61 88.14,47.88 84.4,47.88 X18.3 | 89.41,46.61 89.41,54.48 | X17.1 87.86,56.03 89.41,54.48 | 89.41,54.48 89.41,59.82 | X17.3 88.11,61.11 89.41,59.82 | 89.41,59.82 89.41,67.44 | X16.1 87.4,69.44 89.41,67.44 | 89.41,67.44 89.41,73.79 | X16.3 88.67,74.52 89.41,73.79 | 89.41,73.79 89.41,82.04 | X15.1 88.85,82.6 89.41,82.04 | 89.41,82.04 89.41,86.61 | X15.3 88.34,87.68 89.41,86.61 | 89.41,86.61 89.41,91.69 86.11,95 74.55,95 74.32,94.77 X14.1 74.32,95.61 72.64,97.28 70.23,97.28 | X14.3 69.24,96.29 70.23,97.28 | 70.23,97.28 62.1,97.28 | X13.1 61.21,96.39 62.1,97.28 | 62.1,97.28 56.39,97.28 56.13,97.03 | 56.13,97.03 X13.3 | 56.13,97.03 55.88,97.28 48.39,97.28 | 48.39,97.28 47.55,96.44 X12.1 | 48.39,97.28 43.18,97.28 | X12.3 42.47,96.57 43.18,97.28 | 43.18,97.28 36.83,97.28 | 36.83,97.28 34.14,94.59 X10.1 | X10.3 29.06,96.11 30.23,97.28 | 36.83,97.28 30.23,97.28 | 30.23,97.28 21.21,97.28 | 21.21,97.28 20.65,96.72 X9.1 | 21.21,97.28 15.37,97.28 | 15.37,97.28 15.37,94.18 X9.3 | 15.37,97.28 8.76,97.28 5.49,94 X3.1 3.45,90.58 2.03,89.15 2.03,86.61 | X3.3 3.15,85.5 2.03,86.61 | 2.03,86.61 2.03,79.38 | X4.1 3.73,77.67 2.03,79.38 | 2.03,79.38 2.03,73.53
  Top 1.016: X4.3 2.97,72.59 2.03,73.53 | 2.03,73.53 2.03,65.79 | X5.1 2.97,64.85 2.03,65.79 | 2.03,65.79 2.03,61.21 | X5.3 3.48,59.77 2.03,61.21 | 2.03,61.21 2.03,53.34 | X6.1 3.53,51.84 2.03,53.34 | 2.03,53.34 2.03,47.88 | X6.3 3.15,46.76 2.03,47.88 | 2.03,47.88 2.03,40.39 | X7.1 3.38,39.04 2.03,40.39 | 2.03,40.39 2.03,35.18 | X7.3 3.25,33.96 2.03,35.18 | 2.03,35.18 2.03,27.3 | X8.1 3.33,26.01 2.03,27.3 | 2.03,27.3 2.03,22.86 4.06,20.83 4.17,20.93 X8.3 | JP1.6 32.5,61.15 C3.2 | IC4.1 63.27,51.77 | 33.66,1.52 23.5,1.52 | 23.5,1.52 18.12,1.52 14.59,5.05 X1.2 | 23.5,1.52 X22.2 | 43.31,1.52 X21.2 | 43.31,1.52 63.4,1.52
  Bottom 0.508: IC3.1 42.8,73.03 33.98,64.21 JP1.6 33.81,62.64 32.38,61.21 32.38,52.83 31.88,52.32 | T4.1 75.56,80.64 83.95,80.64 84.18,80.87 X15.1 | T5.1 84.3,74.55 X16.3 | T6.1 76.83,68.07 83.19,68.07 84.33,69.22 X16.1 | T7.1 77.17,34.75 X19.3 | T8.1 67.69,26.67 81.33,26.67 X19.1 | Q8.1 37.72,81.28 40.64,81.28 40.64,83.57 40.13,84.07 | Q7.1 29.06,90.14 X10.3 | Q1.1 9.02,84.45 7.98,85.5 X3.3 | X4.3 8.71,72.59 Q2.1 | IC2.2 19.63,42.24 21.59,44.2 21.59,48.39 20.07,49.91 | 20.07,49.91 Q4.1 | 20.07,49.91 20.07,53.98 Q3.1 | Q6.1 31.88,48.9 31.88,52.32 | 31.88,52.32 30.48,53.72 Q5.1
  Bottom 0.61: IC2.8 21.84,29.23 21.84,38.99 21.13,39.7 IC2.3 IC2.2 | JP2.2 62.26,67.21
  Bottom 0.813: JP2.2 JP2.4 JP2.6 JP2.8 JP2.10 JP2.12 JP2.14 JP2.16 62.26,42.93 62,42.67 U$20.GND1 | T1.1 48.26,84.07 40.13,84.07 34.14,90.07 X10.1 | T2.1 61.72,91.95 61.47,91.95 61.21,92.2 X13.1 | T3.1 78.74,88.39 78.74,91.31 76.07,93.98 X14.1
  Bottom 1.016: IC4.2 IC4.1 | IC4.8 64.19,33.98 62.26,35.92 62.26,42.93 | 62.26,67.21 63.88,68.83 63.88,72.95 | 63.88,72.95 IC3.8 | IC3.1 46.02,74.6 46.74,75.31 50.16,75.31 | 50.16,75.31 51.1,74.37 IC3.3 | 50.16,75.31 62.74,75.31 63.88,74.17 63.88,72.95 | X9.3 15.57,91.11 18.36,88.32 IC1.1 IC1.2 IC1.3 20.02,76.76 20.83,75.95 20.83,65.28 19.61,64.06 IC1.8
  pour Bottom: 0.64,99.44 92.84,99.44 92.84,0.25 0.38,0.25 0.25,0.13 0.25,99.06
N$1
  Top 0.508: R9.1 35.74,81.97 36.7,82.93 Q8.2
N$2
  Top 0.508: R8.1 23.01,85.06 27.15,85.06 Q7.2
N$3
  Top 0.508: R15.1 60.98,36.17 67.69,29.46 T7.2
N$4
  Top 0.508: Q6.2 30.23,50.42 30.23,56.01 28.45,57.78 28.45,62.38 R7.1
N$5
  Top 0.508: Q5.2 26.24,56.95 R6.1
N$6
  Top 0.508: Q4.2 20.68,54.71 R5.1
N$7
  Top 0.508: R4.1 17.65,60.17 Q3.2
N$8
  Top 0.508: Q2.2 11.81,75.82 13.18,77.19 R3.1
N$9
  Top 0.508: Q1.2 14.1,82.55 15.82,84.28 R2.1
N$10
  Top 0.61: U$20.D2 55.98,45.19 55.98,45.16
  Top 1.016: 55.98,45.16 JP2.15
N$11
  Top 0.508: Q1.3 13.34,85.79 U$1.P1 11.88,87.25 R43.1
N$12
  Top 0.508: Q2.3 13.08,70.55 U$2.P1 11.43,67.72 R44.1
N$13
  Top 0.508: U$3.P1 11.57,59.93 Q3.3 14.22,52.96 R45.1
N$14
  Top 0.508: U$4.P1 11.8,44.63 11.87,44.63 16.51,49.28 Q4.3 R46.1
N$15
  Top 0.508: X3.2 9.24,88.04 U$1.P3
N$16
  Top 0.508: U$2.P3 7.87,71.57 7.87,74.42 7.11,75.18 7.06,75.13 X4.2
N$17
  Top 0.61: U$20.D3 55.98,47.73 55.98,47.7
  Top 1.016: 55.98,47.7 JP2.13
N$18
  Top 0.508: U$3.P3 8.05,62.31 X5.2
N$19
  Top 0.508: U$4.P3 5.86,49.3 X6.2
N$20
  Top 0.61: U$20.D4 55.98,50.27 55.98,50.24
  Top 1.016: 55.98,50.24 JP2.11
N$21
  Top 0.61: 55.98,52.78 55.98,52.81 U$20.D5
  Top 1.016: 55.98,52.78 JP2.9
N$22
  Top 0.61: U$20.D6 55.98,55.35 55.98,55.32
  Top 1.016: 55.98,55.32 JP2.7
N$23
  Top 0.813: U$20.D7 59.51,57.91 59.59,57.99
  Top 1.016: 59.59,57.99 JP2.5
N$24
  Top 0.813: U$20.D8 59.51,60.45 59.59,60.53
  Top 1.016: 59.59,60.53 JP2.3
N$25
  Top 0.813: U$20.D9 59.51,62.99 59.59,63.07
  Top 1.016: 59.59,63.07 JP2.1
N$26
  Top 0.813: R1.2 53.11,87.76 T1.2
N$27
  Top 0.508: 44.07,85.85 41,85.85 R35.1
  Top 0.61: T1.3 44.07,85.85 43.31,86.61 U$12.P1
N$28
  Top 0.508: U$19.P1 78.23,31.62 76.43,29.82 R42.1 65.66,26.16 T8.3
N$29
  Top 0.508: R40.1 76.45,70.23 75.36,69.14 75.36,68.27 74.74,67.64 73.86,67.64 T6.3 74.3,65.53 76.58,65.53 78.25,63.87 U$17.P1
N$30
  Top 0.61: R2.2 15.82,80.57 16.38,80.01 16.38,75.44 17.6,74.22 IC1.4
N$31
  Top 0.61: IC1.5 15.37,74.68 15.37,79.12 14.38,80.11 R3.2
N$32
  Top 1.016: R4.2 14.88,69.14 IC1.6
N$33
  Top 1.016: R5.2 18.52,61.09 14.97,64.63 16.94,66.6 IC1.7
N$34
  Top 0.61: R6.2 25.98,61.98 IC1.9
N$35
  Top 0.61: R7.2 28.19,65.33 28.19,65.53 27.13,66.6 IC1.10
N$36
  Top 0.61: R8.2 19.76,85.57 21.11,84.23 21.11,71.98 23.95,69.14 IC1.11
N$37
  Top 0.508: IC1.12 24.97,71.68 22.73,73.91 22.73,83.82 23.11,84.2 28.45,84.2 30.68,81.97 R9.2
N$38
  Top 0.508: T8.2 62.81,27.69 R16.1
N$39
  Top 0.508: R14.1 72.9,72.01 73.41,72.01 74.3,71.12 T6.2
N$40
  Top 0.508: U$5.P3 7.79,37.03 7.78,37.06 7.22,36.5 X7.2
N$41
  Top 0.508: X8.2 9.57,23.47 U$6.P3
N$42
  Top 0.508: X9.2 18.11,90.02 U$7.P3
N$43
  Top 0.508: T5.3 73.03,75.31 74.06,75.31 75.69,76.95 75.69,76.96 75.95,77.22 R39.1 76.68,75.66 U$16.P1
N$44
  Top 0.508: R41.1 76.56,54.63 77.72,53.47 78.49,53.47 78.49,47.88 77.81,47.2 U$18.P1 77.34,46.35 76.83,45.85 76.83,31.88 T7.3
N$45
  Top 0.508: R13.1 70.05,77.85 73.03,77.85 73.53,77.34 T5.2
N$46
  Top 0.61: 45.04,93.95 X12.2
  Top 0.813: U$12.P3 45.01,90.51 X12.2
N$47
  Top 0.508: X13.2 58.56,93.86 58.61,93.81 U$13.P3
N$48
  Top 0.508: 71.7,93.9 X14.2
  Top 0.813: U$14.P3 71.7,89.52 71.7,93.9
N$49
  Top 0.508: 84.13,85.09 X15.2
  Top 0.813: U$15.P3 81.66,81.79 81.66,83.44 83.31,85.09 84.13,85.09
N$50
  Top 0.508: X16.2 81.24,71.98 U$16.P3
N$51
  Top 0.508: X17.2 83.07,59.83 80.64,59.83 U$17.P3
N$52
  Top 0.508: X18.2 80.77,45.41 | 80.77,45.41 79.76,45.41 | U$18.P3 80.76,45.4 80.77,45.41
N$53
  Top 0.508: 84.25,32.28 X19.2 82.79,30.67 U$19.P3
N$54
  Top 0.508: U$8.P3 31.6,91.23 X10.2
N$55
  Top 0.508: T4.3 73.41,80.14 76.45,83.19 R38.1
  Top 0.813: U$15.P1 76.45,82.93 76.45,83.19
N$56
  Top 0.508: U$8.P1 36.76,87.31 37.21,86.87 37.21,84.33 Q8.3 36.7,84.84 R50.1
N$57
  Top 0.508: R12.1 69.32,82.04 T4.2
N$58
  Top 0.813: R37.1 69.9,86.33 U$14.P1 71.25,87.19 71.25,86.23 74.04,86.23 T3.3
N$59
  Top 0.508: U$7.P1 21.76,87.25 24.64,87.25 | Q7.3 29.01,87.55 28.13,87.55 27.83,87.25 24.64,87.25 | R49.1 24.64,87.25
N$60
  Top 0.508: T3.2 76.58,85.6 75.41,84.43 R11.1
N$61
  Top 0.508: R10.1 63.04,87.25 T2.2
N$62
  Top 0.508: R36.1 56.24,85.95 56.9,86.61 56.9,86.98 U$13.P1 57.8,87.75 58.79,86.75 61.09,86.75 62.98,88.65 63.37,88.65 65.15,86.87 T2.3
N$63
  Top 0.508: Q6.3 26.92,46.48 16.13,46.48 14.22,44.58 14.22,34.67 12.83,33.27 12.83,24.1 12.65,23.77 U$6.P1 13.4,22.57 R48.1
N$64
  Top 0.508: U$5.P1 13.21,37.07 13.21,41.53 | Q5.3 26.29,52.32 22.48,48.51 16.89,48.51 13.21,44.83 13.21,41.53 | R47.1 13.21,41.53
P0
  Top 0.508: R19.1 17.02,39.75 17.82,38.95 18.09,38.95 18.33,38.71 18.33,38.44 IC2.4
  Bottom 0.61: IC2.4 14.35,42.42 14.35,76.33 7.72,82.96 X3.4
P1
  Top 0.508: IC2.5 19.33,34.9 R20.1
  Bottom 0.61: IC2.5 12.32,41.91 12.32,63.27 X4.4
P2
  Top 0.508: IC2.6 17.09,29.57 R21.1
  Bottom 0.61: IC2.6 10.54,41.15 10.54,54.74 8.05,57.23 X5.4
P3
  Top 0.508: IC2.7 17.14,27.08 17.14,24.64 16.87,24.36 R22.1
  Bottom 0.61: IC2.7 18.97,29.54 8.64,39.88 8.64,43.05 7.47,44.22 X6.4
P4
  Top 0.508: R23.1 27.2,26.97 IC2.9
  Bottom 0.61: IC2.9 25.25,25.02 16.89,25.02 10.49,31.42 X7.4
P5
  Top 0.508: R24.1 29.67,29.54 IC2.10
  Bottom 0.61: X8.4 10.9,18.39 16,23.5 28.7,23.5 30.23,25.02 30.23,28.19 28.88,29.54 IC2.10
P6
  Top 0.508: R25.1 29.9,32.08 IC2.11
  Bottom 0.61: IC2.11 24.56,32.08 22.86,33.78 22.86,56.52 15.24,64.14 15.24,86.74 12.57,89.41 12.57,93.52 X9.4
P7
  Top 0.508: R26.1 29.77,34.62 IC2.12
  Bottom 0.61: IC2.12 24.94,34.62 24.26,35.31 24.26,56.9 22.86,58.29 22.86,91.06 25.78,93.98 X10.4
P8
  Top 0.508: R27.1 68.71,52.55 68.71,51.18 68.58,51.18 67.82,50.42 64.77,50.42 64.26,49.91 64.26,46.23 66.34,44.15 IC4.4
  Bottom 0.508: IC4.4 65.71,44.15 64.26,45.59 64.26,65.66 66.8,68.2 66.8,81.53 61.85,86.49 54.23,86.49 49.78,90.93 40.89,90.93 39.93,91.9 X12.4
P9  (via drill 0.35)
  Top 0.508: R28.1 67.56,61.62 v67.56,63.37
  Bottom 0.508: X13.4 53.59,92.46 57.34,88.71 57.4,88.65 63.36,88.65 64.31,87.69 64.31,87.45 64.39,87.38 65.66,87.38 67.69,85.34 67.69,63.37 | IC4.5 68.2,43.43 68.2,63.37 67.69,63.37 | 67.69,63.37 v67.56,63.37
P10  (via drill 0.35)
  Top 0.508: R29.1 68.58,65.51 v68.58,67.56
  Bottom 0.508: IC4.6 68.4,39.06 69.09,39.75 69.09,67.31 | 69.09,67.31 69.09,87 66.7,89.38 X14.4 | 69.09,67.31 68.83,67.56 v68.58,67.56
P11  (via drill 0.35)
  Top 0.508: v69.98,71.5 67.84,71.5 R30.1
  Bottom 0.508: X15.4 79.86,85.9 75.49,85.9 69.95,80.37 69.95,71.5 | 69.95,71.5 69.95,37.85 68.63,36.52 IC4.7 | 69.95,71.5 v69.98,71.5
P12  (via drill 0.35)
  Top 0.508: R31.1 71.02,69.88 v72.26,71.12
  Bottom 0.508: IC4.9 70.92,33.98 70.61,34.29 70.61,70.87 70.87,71.12 v72.26,71.12 73.53,72.39 73.53,74.93 75.69,77.09 84.3,77.09 X16.4
P13  (via drill 0.35)
  Top 0.508: v77.09,62.74 76.1,62.74 R32.1
  Bottom 0.508: IC4.10 72.57,36.52 71.27,37.82 71.27,62.13 72.8,63.65 77.85,63.65 | 77.85,63.65 X17.4 | 77.85,63.65 77.85,63.37 77.22,62.74 v77.09,62.74
P14  (via drill 0.35)
  Top 0.508: v75.18,57.66 75.08,57.76 R33.1
  Bottom 0.508: X18.4 80.47,54.36 75.31,54.36 | 75.31,54.36 72.64,54.36 72.14,53.85 72.14,39.62 72.77,38.99 72.85,39.06 IC4.11 | 75.31,54.36 75.31,57.53 v75.18,57.66
P15
  Top 0.508: IC4.12 76.07,43.69 76.07,47.24 77.09,48.26 R34.1
  Bottom 0.508: X19.4 80.31,37.29 76,41.6 IC4.12
RST
  Bottom 0.508: JP1.5 35.97,62.64 35.18,61.85 35.18,56.39 37.34,54.23 37.34,43.48
  Bottom 0.813: 37.34,43.48 37.34,42.42 39.62,40.13 U$20.RST
S8
  Top 0.508: IC3.4 53.65,77.55 52.45,78.74 52.45,84.68 53.01,85.24 R1.1
S9  (via drill 0.35)
  Top 0.508: IC3.5 56.19,77.27 v56.52,77.6 | 55.91,83.72 v55.88,83.69 56.94,84.75 56.95,84.75 57.19,84.99 57.19,85 57.63,85.45 R10.2
  Bottom 0.508: v56.52,77.6 57.53,78.61 57.53,82.04 v55.88,83.69
S10
  Top 0.508: IC3.6 58.73,77.42 57.53,78.61 57.53,83.95 71.37,83.95 R11.2
S11
  Top 0.508: IC3.7 61.27,77.8 59.94,79.12 59.94,82.04 60.96,83.06 65.46,83.06 R12.2
S12
  Top 0.508: R13.2 66.42,80.23 66.39,80.26 64.19,80.26 IC3.9
S13
  Top 0.508: R14.2 66.19,75.72 IC3.10
S14
  Top 0.508: R15.2 60.96,41.83 60.96,71.25 60.91,71.3 60.82,71.3 60.2,71.92 60.2,72.01 59.94,72.26 59.94,77.98 58.67,79.25 58.67,80.59 IC3.11
S15
  Top 0.508: R16.2 59.97,34.39 59.31,35.05 59.31,38.35 58.67,38.99 53.98,38.99 53.98,57.53 | 53.98,57.53 53.85,57.66 | 53.98,57.53 53.98,70.87 54.99,71.88 54.99,79.45 IC3.12
V24
  Top 0.508: 42.42,88.9 43.66,88.9 43.69,88.87 44.27,88.87 U$12.P2 | U$13.P2 58.66,88.65 56.39,88.65 56.24,88.8 R36.2 55.73,88.8 55.5,89.03 | R37.2 69.76,88.38 72.53,88.38 72.9,88.01 U$14.P2 | 79.5,83.21 79.5,81.09 79.17,80.77 79.17,80.57 78.23,79.63 U$15.P2 79.53,77.95 R39.2 79.53,74.32 79.07,73.86 79.07,73.59 78.99,73.52 78.99,72.52 78.74,72.26 U$16.P2 79.53,70.91 R40.2 79.53,61.29 79.19,60.95 79.19,60.77 78.25,59.83 U$17.P2 79.4,58.28 R41.2 79.4,46.89 78.7,46.19 78.7,45.78 78.61,45.69 78.61,44.7 78.36,44.45 U$18.P2 77.81,37.38 79.38,35.81 79.38,31.41 79.2,31.24 79.2,30.31 78.61,29.72 U$19.P2 79.27,28.7 R42.2 | U$8.P2 36.46,89.15 35.46,88.15 35.46,87.7 35.43,87.67 35.43,87.5 35.05,87.12 33.63,87.12 | R50.2 33.63,87.12 | 33.63,87.12 33.15,87.12 30.1,90.17 24.64,90.17 | 24.64,90.17 21.68,90.17 U$7.P2 21.21,89.54 20.27,88.6 20.27,88.18 20.07,87.97 20.07,87.63 18.29,87.63 17.46,88.46 | R49.2 24.64,90.17 | 17.46,88.46 17.02,88.9 17.02,89.79 11.88,89.79 U$1.P2 10.67,88.58 10.67,87 10.67,86.49 9.4,85.22 9.4,71.75 10.35,70.8 10.67,70.8 | R43.2 17.04,88.04 17.46,88.46 | 10.67,70.8 U$2.P2 | 10.67,70.8 10.67,69.6 10.54,69.47 10.54,68.96 10.29,68.71 9.14,68.71 8.64,68.2 8.64,66.14 R44.2 10.67,62.47 U$3.P2 10.39,60.92 R45.2 R46.2 10.39,47.56 11.07,46.88 | U$4.P2 11.07,46.88 | 10.02,44.06 U$5.P2 12.22,37.55 11.33,36.65 11.33,36.47 10.92,36.07 10.92,34.29 11.46,33.75 U$6.P2 10.54,23.55 10.54,21.34 12.32,19.56 14.1,19.56 | 11.07,46.88 11.07,45.36 10.72,45.01 10.72,44.75 10.02,44.06 | 20.04,19.16 19.63,19.56 14.1,19.56 | R48.2 14.1,19.56 | R47.2 10.13,43.95 10.02,44.06
  Top 0.508: 41.91,88.39 41.3,88.39 R35.2
  Top 0.61: 36.46,89.15 38.09,89.15 38.86,88.39 41.91,88.39 42.42,88.9
  Top 0.813: U$12.P2 47.2,89.92 54.61,89.92 55.5,89.03 56.01,89.03 | U$13.P2 62.5,90.68 67.46,90.68 R37.2 | U$14.P2 72.9,88.52 75.82,91.44 78.36,91.44 79.5,90.3 79.5,83.21 R38.2 | C8.1 20.95,9.41 X22.1
  Top 1.016: C8.1 20.07,11.39 20.04,11.35 C4.+ 20.04,19.16
  Top 1.27: 21.59,9.87 C8.1
  Bottom 1.016: X1.1 11.89,3.61 13.97,1.52 19.18,1.52 20.95,3.3 X22.1
VCC  (via drill 0.35)
  Top 0.508: U$10.VCC 45.22,28.32 43.18,30.35 43.18,41.4 41.83,42.75 | IC2.16 31.55,44.78 34.09,47.32 34.09,57.45 JP1.2 33.98,55.8 38.23,51.56 45.97,51.56 53.21,58.8 53.21,65.91 51.56,67.56 | R18.2 47.24,68.86 R17.2 | R17.2 48.51,72.97 IC3.2 48.56,75.13 46.02,77.67 IC3.16 | R17.2 49,70.13 51.56,67.56 | IC4.16 66.5,59.26 | 66.5,59.26 66.29,59.46 66.29,60.05 | 66.29,60.05 66.29,65.91 | 66.29,65.91 64.64,67.56 | 64.64,67.56 62.61,69.6 v62.1,69.6 | 51.56,67.56 51.56,67.69 v52.07,68.2 | IC2.1 19.3,44.48 R19.2 16.87,44.32 15.24,44.32 15.24,38.73 | R20.2 16.23,37.74 15.24,38.73 | 15.24,38.73 15.24,33.15 | 15.24,33.15 15.98,32.41 R21.2 | R22.2 13.84,28.6 13.84,31.75 15.24,33.15 | R23.2 23.84,23.75 23.34,24.26 | 29.69,22.32 30.23,22.86 R24.2 32.79,28.7 R25.2 R26.2 | 29.46,22.1 23.34,22.1 | IC4.3 67.13,46.69 72.21,51.77 IC4.16 | R34.2 74.32,52.09 IC4.16 | R30.2 65,68.45 | 65,68.45 65,67.92 64.64,67.56 | 65,68.45 70.36,68.45 70.36,67.82 71.14,67.03 R31.2 72.11,65.28 R32.2 72.11,60.07 R33.2 | R29.2 66.14,65.91 66.29,65.91 | R28.2 66.29,60.05 | R27.2 66.47,59.26 66.5,59.26
  Top 0.61: IC2.16 IC2.1 | IC2.16 31.17,44.78 33.2,42.75 | 23.34,22.1 23.34,24.26 23.34,40.89 IC2.16 | U$20.VCC 40.84,42.75 41.83,42.75 | C7.+ 29.69,22.1
  Top 0.813: U$20.VCC 33.27,42.67 33.2,42.75
  Top 1.016: X11.1 31.11,10.17 C6.1 31.28,13.54 C7.+ | JP1.2 32.75,57.56 C3.1 | 29.69,22.32 29.69,22.1 29.46,22.1
  Bottom 0.508: IC3.16 45.31,79.93 29.29,79.93 27.38,81.84 IC1.16 | v62.1,69.6 60.71,68.2 v52.07,68.2
  Bottom 1.016: X11.1 31.11,2.79 32.38,1.52 39.24,1.52 40.77,3.05 X21.1

### Text on the board
tPlace: + - | A | B | GND
tNames: 9 | 11 | 7 | 8 | 10 | 1 | 12 | 2 | 13 | 3 | 14 | VCC | 4 | 15 | 5 | 16 | 6 | E-locker.pl / SLAVE / rev 2.0 | 24V | + 5V -